# Altium schematic sheet PHY6222-QFN32+pa-20210705.SchDoc
size A4
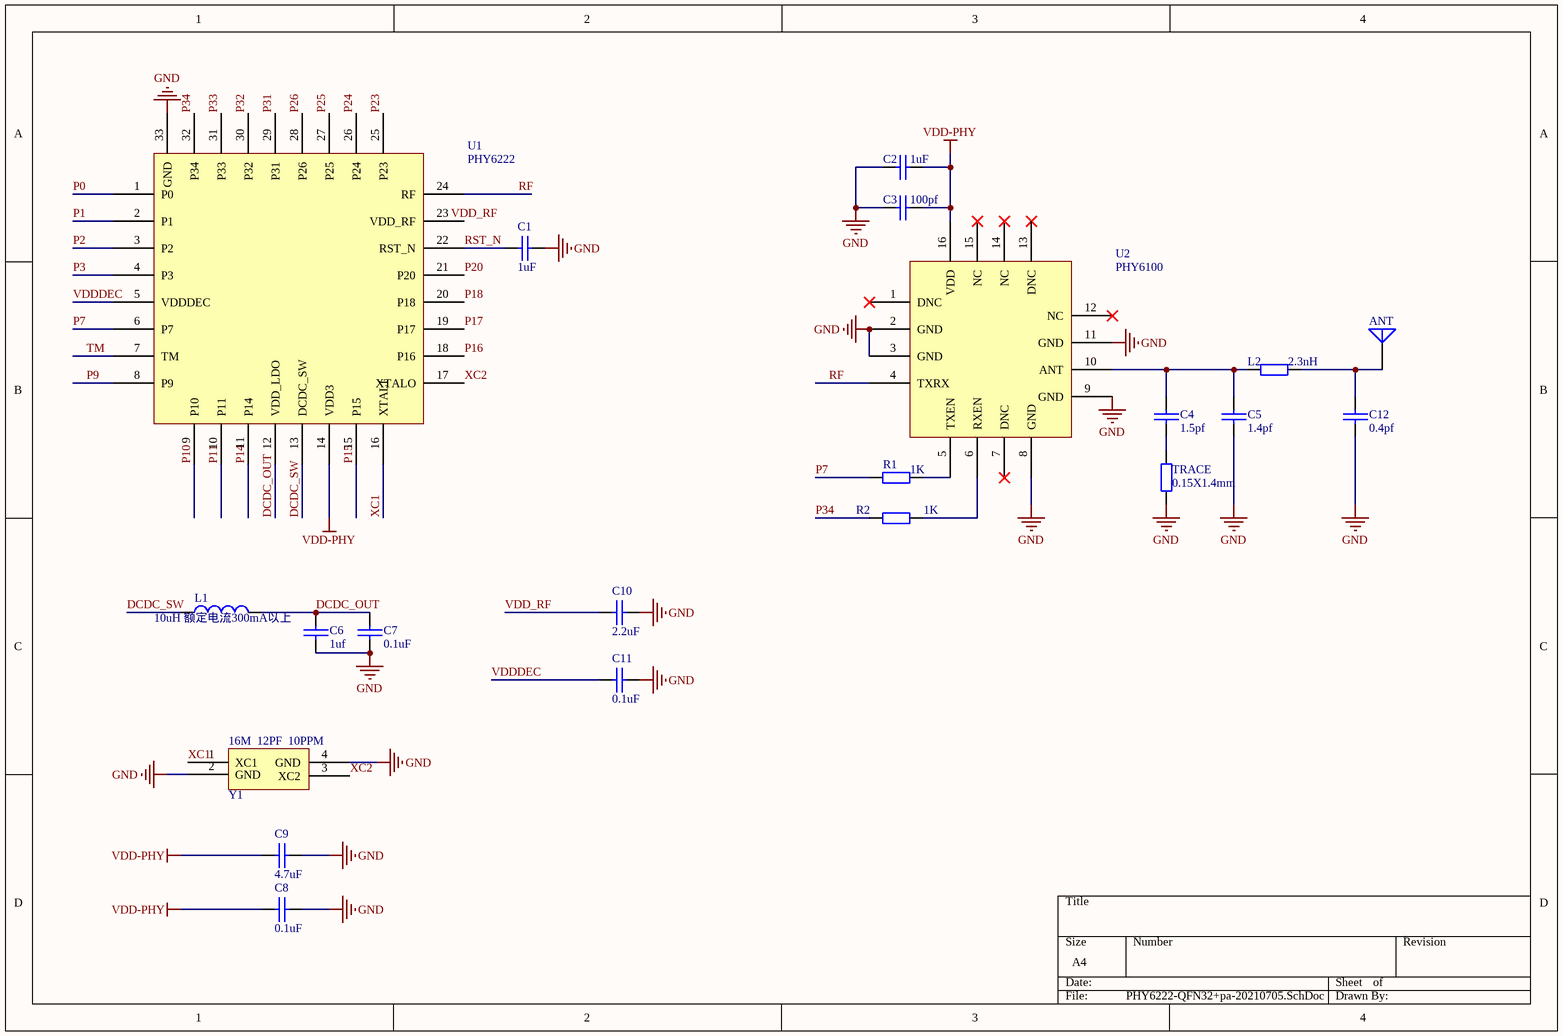
[diagram p0: PHY6222-QFN32+pa-20210705.SchDoc]

## Parts
16M_12PF_10PPM  Y1  [3225]
ANT  Antenna  [PIN1]  (value not drawn)
C1  1uF  [C0603]
C2  1uF  [C0603]
C3  100pf  [C0603]
C4  1.5pf  [C0603]
C5  1.4pf  [C0603]
C6  1uf  [C0603]
C7  0.1uF  [C0603]
C8  0.1uF  [C0603]
C9  4.7uF  [C0603]
C10  2.2uF  [C0603]
C11  0.1uF  [C0603]
C12  0.4pf  [C0603]
L1  10uH 额定电流300mA以上  [SMD2016]
L2  value 2.3nH  [AXIAL-0.4]  (hidden comment: Res2)
R1  value 1K  [AXIAL-0.4]  (hidden comment: Res2)
R2  value 1K  [AXIAL-0.4]  (hidden comment: Res2)
TRACE  value 0.15X1.4mm  [AXIAL-0.4]  (hidden comment: Res2)
U1  PHY6222  [QFN32]
U2  PHY6100

## Nets
GND: 16M_12PF_10PPM.2(GND) 16M_12PF_10PPM.4(GND) C1.1 C2.1 C3.2 C5.2 C6.2 C7.2 C8.2 C9.2 C10.2 C11.2 C12.2 TRACE.1 U1.33(GND) U2.2(GND) U2.3(GND) U2.8(GND) U2.9(GND) U2.11(GND)
VDD-PHY: C2.2 C3.1 C8.1 C9.1 U1.14(VDD3) U2.16(VDD)
DCDC_OUT: C6.1 C7.1 L1.2 U1.12(VDD_LDO)
DCDC_SW: L1.1 U1.13(DCDC_SW)
P0: U1.1(P0)
P1: U1.2(P1)
P2: U1.3(P2)
P3: U1.4(P3)
P7: R1.1 U1.6(P7)
P9: U1.8(P9)
P10: U1.9(P10)
P11: U1.10(P11)
P14: U1.11(P14)
P15: U1.15(P15)
P16: U1.18(P16)
P17: U1.19(P17)
P18: U1.20(P18)
P20: U1.21(P20)
P23: U1.25(P23)
P24: U1.26(P24)
P25: U1.27(P25)
P26: U1.28(P26)
P31: U1.29(P31)
P32: U1.30(P32)
P33: U1.31(P33)
P34: R2.1 U1.32(P34)
RF: U1.24(RF) U2.4(TXRX)
RST_N: C1.2 U1.22(RST_N)
TM: U1.7(TM)
VDD_RF: C10.1
VDDDEC: C11.1 U1.5(VDDDEC)
XC1: 16M_12PF_10PPM.1(XC1) U1.16(XTALI)
XC2: 16M_12PF_10PPM.3(XC2) U1.17(XTALO)
NetANT_1: ANT.1(A) C12.1 L2.2
NetC4_1: C4.1 C5.1 L2.1 U2.10(ANT)
NetC4_2: C4.2 TRACE.2
NetR1_2: R1.2 U2.5(TXEN)
NetR2_2: R2.2 U2.6(RXEN)

Not connected (* = marked no-connect by the designer): U1 23(VDD_RF); U2 1(DNC)* 7(DNC)* 12(NC)* 13(DNC)* 14(NC)* 15(NC)*

## Notes on the sheet
- Labels drawn without touching a wire or pin: VDD_RF

## Library data of the parts
16M_12PF_10PPM = 3225
ANT = Antenna: Generic Antenna; Published: 24-Mar-1999; LatestRevisionDate: 17-Jul-2002; LatestRevisionNote: Re-released for DXP Platform.; PackageReference: PIN1; Publisher: Altium Limited
C1-C12 = 电容瓷片
L1 = 电感: Code_IEC: 1005; Value: 2.2uH; Published: 8-Jun-2000; LatestRevisionDate: 17-Jul-2002; LatestRevisionNote: Re-released for DXP Platform.; PackageReference: 0402-A; Publisher: Altium Limited; Code_JEITA: 0402
L2 R1 R2 TRACE = Res2: Resistor; Published: 8-Jun-2000; LatestRevisionDate: 17-Jul-2002; LatestRevisionNote: Re-released for DXP Platform.; PackageReference: AXIAL-0.4; Publisher: Altium Limited
U1 = QFN32-1202
U2 = Component_1